# Altium schematic sheet LDO_3.3V.SchDoc
size A4
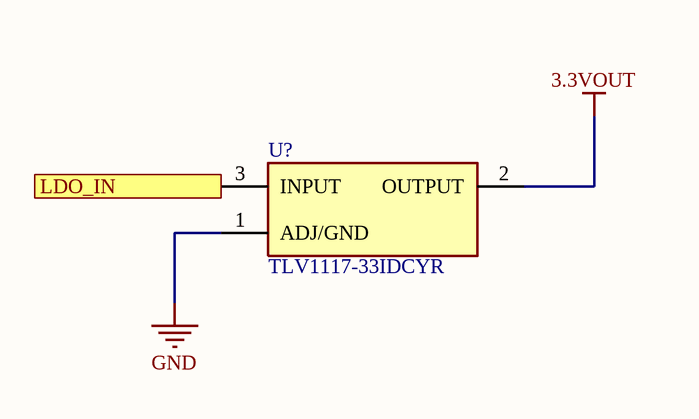
[diagram p0: LDO_3.3V.SchDoc]

## Parts
U?  TLV1117-33IDCYR  [TLV1117]

## Ports
LDO_IN

## Nets
3.3VOUT: U?.2(OUTPUT)
GND: U?.1(ADJ/GND)
LDO_IN: U?.3(INPUT) ; port LDO_IN

## Library data of the parts
U? = TLV1117-33IDCYR: Linear Voltage Regulator IC 3.3V 800MA SOT223-4; Manufacturer: Texas Instruments; Datasheet: http://www.ti.com/lit/ds/symlink/tlv1117.pdf?HQS=TI-null-null-digikeymode-df-pf-null-wwe&ts=1590668900314; Manufacturer Part Number: TLV1117-33IDCYR; Supplier Part Number: 296-21112-1-ND; Supplier: Digikey